# Altium schematic sheet ST_LINK_V2-1.SchDoc: ST_LINK_V2.1
size 320 x 234 mm; Date: 2/28/26; Author: Yasir Shahzad; DrawnBy: Yasir Shahzad; Organization: Mastermind; SheetNumber: 1; SheetTotal: 1
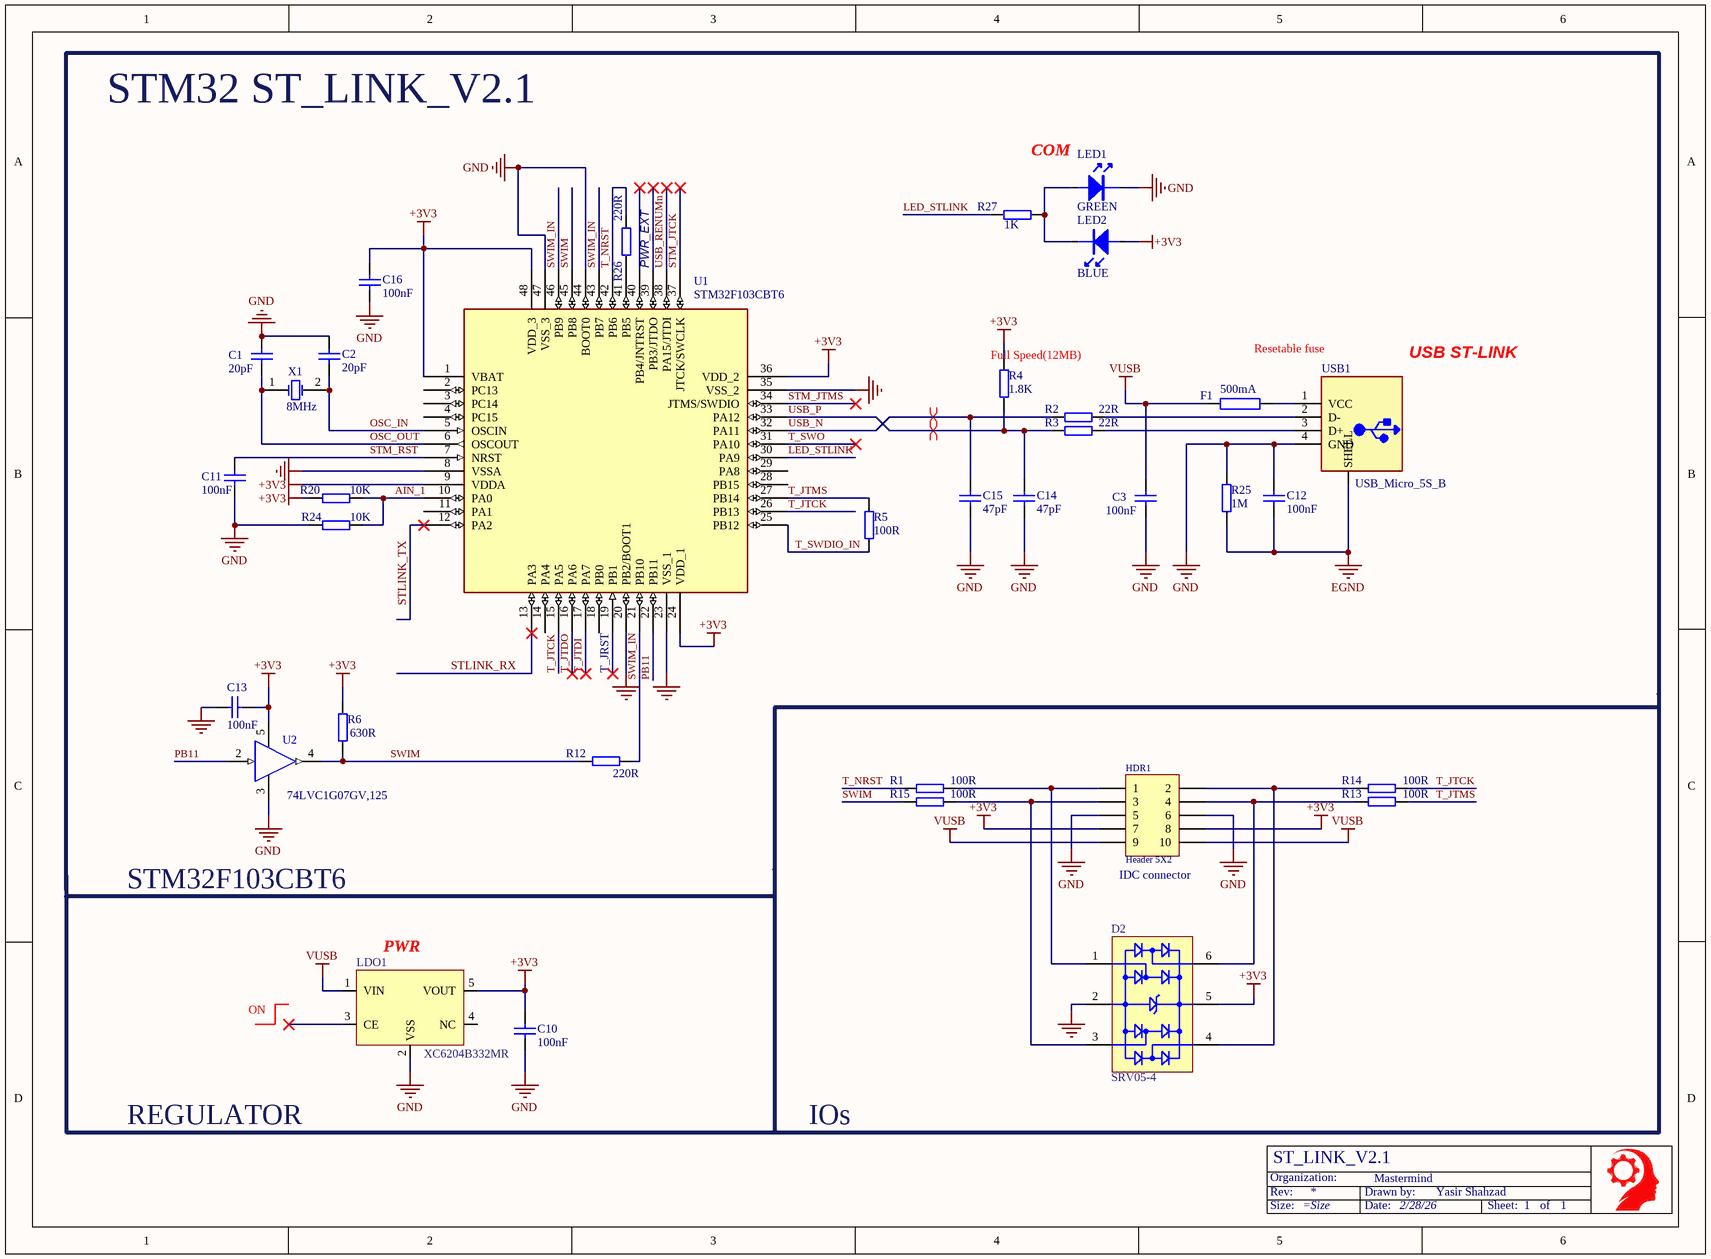
[diagram p0: ST_LINK_V2-1.SchDoc]

## Parts
*  TitleBlock  (value not drawn)  (graphical)
C1  20pF  [C0603-NO]
C2  20pF  [C0603-NO]
C3  100nF  [C0603-NO]
C10  100nF  [C0603-NO]
C11  100nF  [C0603-NO]
C12  100nF  [C0603-NO]
C13  100nF  [C0603-NO]
C14  47pF  [C0603-NO]
C15  47pF  [C0603-NO]
C16  100nF  [C0603-NO]
D2  SRV05-4  [SOT23-6]
F1  value 500mA  [F1206]  (hidden comment: Resistor_FUSE)
HDR1  Header 5X2  [IDC10_2SIDED]
LDO1  XC6204B332MR  [SOT23-5L]
LED1  value GREEN  [CHIPLED_0603 - NO]  (hidden comment: *)
LED2  value BLUE  [CHIPLED_0603 - NO]  (hidden comment: *)
R1  100R  [R0603-NO]
R2  22R  [R0603-NO]
R3  22R  [R0603-NO]
R4  1.8K  [R0603-NO]
R5  100R  [R0603-NO]
R6  630R  [R0603-NO]
R12  220R  [R0603-NO]
R13  100R  [R0603-NO]
R14  100R  [R0603-NO]
R15  100R  [R0603-NO]
R20  10K  [R0603-NO]
R24  10K  [R0603-NO]
R25  1M  [R0603-NO]
R26  220R  [R0603-NO]
R27  1K  [R0603-NO]
U1  STM32F103CBT6  [QFP48 7X7]
U2  74LVC1G07GV,125  [SOT23-5L]
USB1  NAME: USB_Micro_5S_B  [USB-A-SMT_48037-0001]  (hidden comment: USB ConnectorsUSBMINIB - Surface Mount Female Mini-B USB Connector 4UConnector: 06564   By microbuilder.euThru-hole RA Female Mini-B USB Connector 4UConnector: 18732   By ladyada.net)
X1  8MHz  [XTAL1]

## Nets
+3V3: C10.2 C13.2 C16.2 D2.5(VBUS) HDR1.7 HDR1.8 LDO1.5(VOUT) LED2.A R4.1 R6.1 R20.1 U1.1(VBAT) U1.9(VDDA) U1.24(VDD_1) U1.36(VDD_2) U1.48(VDD_3) U2.5(VCC)
EGND: C12.2 R25.2 USB1.5(SHELL)
GND: C1.2 C2.2 C3.1 C10.1 C11.1 C12.1 C13.1 C14.1 C15.1 C16.1 D2.2(GND) HDR1.5 HDR1.6 LDO1.2(VSS) LED1.C(K) R24.2 R25.1 U1.8(VSSA) U1.20(PB2/BOOT1) U1.23(VSS_1) U1.35(VSS_2) U1.44(BOOT0) U1.47(VSS_3) U2.3(GND) USB1.4(GND)
VUSB: C3.2 F1.2 HDR1.9 HDR1.10 LDO1.1(VIN)
AIN_1: R20.2 R24.1 U1.10(PA0)
LED_STLINK: R27.2 U1.30(PA9)
OSC_IN: C2.1 U1.5(OSCIN) X1.2(OSC2)
OSC_OUT: C1.1 U1.6(OSCOUT) X1.1(OSC1)
PB11: U1.22(PB11) U2.2(A)
STLINK_RX: U1.13(PA3)
STLINK_TX: U1.12(PA2)
STM_JTCK: U1.37(JTCK/SWCLK)
STM_JTMS: U1.34(JTMS/SWDIO)
STM_RST: C11.2 U1.7(NRST)
SWIM: R6.2 R12.1 R15.1 U1.45(PB8) U2.4(Y)
SWIM_IN: R12.2 U1.21(PB10) U1.43(PB7) U1.46(PB9)
T_JTCK: R14.2 U1.15(PA5) U1.26(PB13)
T_JTDI: U1.17(PA7)
T_JTDO: U1.16(PA6)
T_JTMS: R5.2 R13.1 U1.27(PB14)
T_NRST: R1.2 R26.1 U1.42(PB6)
T_SWDIO_IN: R5.1 U1.25(PB12)
T_SWO: U1.31(PA10)
USB_N: C15.2 R2.1 U1.32(PA11)
USB_P: C14.2 R3.1 R4.2 U1.33(PA12)
USB_RENUMn: U1.38(PA15/JTDI)
NetD2_1: D2.1(I/O_1) HDR1.1 R1.1
NetD2_3: D2.3(I/O_2) HDR1.3 R15.2
NetD2_4: D2.4(I/O_3) HDR1.2 R14.1
NetD2_6: D2.6(I/O_4) HDR1.4 R13.2
NetF1_1: F1.1 USB1.1(VCC)
NetLED1_A: LED1.A LED2.C(K) R27.1
NetR2_2: R2.2 USB1.2(D-)
NetR3_2: R3.2 USB1.3(D+)
NetR26_2: R26.2 U1.41(PB5)

Not connected (* = marked no-connect by the designer): LDO1 3(CE)* 4(NC); U1 2(PC13) 3(PC14) 4(PC15) 11(PA1) 14(PA4) 18(PB0) 19(PB1)* 28(PB15) 29(PA8) 39(PB3/JTDO)* 40(PB4/JNTRST)*

## Layout directives
differential pair: USB_N, USB_P

## Notes on the sheet
- STM32 ST_LINK_V2.1
- COM
- (near R26) PWR_EXT
- (near R4) Full Speed(12MB)
- (near F1) Resetable fuse
- (near USB1) USB ST-LINK
- (near U1) T_JRST
- (near HDR1) IDC connector
- STM32F103CBT6
- ON
- (near LDO1) PWR
- REGULATOR
- IOs
- (in symbol TitleBlock) Organization:; Rev:; Drawn by:; Size:; Date:; Sheet:; of

## Library data of the parts
* = TitleBlock: Title Block for Schematic Sheets
C1-C3 C10-C16 = Cap_0603: CAP CER ?nF ?V X7R 0603; Value: *
D2 = SRV05-4: Manufacturer: MSKSEMI(美森科); Symbol: SRV05-4_C2836319; Add into BOM: yes; Reverse Stand-Off Voltage (Vrwm): 5V; Maximum Clamping Voltage: 15V; Peak Pulse Power Dissipation (Ppp)@10/1000us: 60W; Breakdown Voltage: 9V; Type: ESD; Device: SRV05-4_C2836319; Supplier: LCSC; Supplier Part: C2836319; Manufacturer Part: SRV05-4; JLCPCB Part Class: Extended Part; LCSC Part Name: SRV05-4; Supplier Footprint: SOT-23-6; Datasheet: https://atta.szlcsc.com/upload/public/pdf/source/20220222/F01BB54FA817A9A0327E7B3253CC806E.pdf; Convert to PCB: yes
F1 = Resistor_FUSE: Resetable fuse
HDR1 = Header 5X2: Header, 5-Pin, Dual row; Revision: 17-Jul-2002: Re-released for DXP Platform.
LDO1 = XC6204B332MR: Manufacturer: TOREX(特瑞仕); Add into BOM: yes; Maximum Input Voltage: 10V; Output Voltage: 3.3V; MAX Output Current: 150mA; Power Supply Rejection Ratio (PSRR): 70dB@(10kHz); Dropout Voltage: 330mV@(100mA); Output Polarity: Positive electrode; Number of Outputs: 1; Symbol: XC6204B332MR; Device: XC6204B332MR; Supplier: LCSC; Manufacturer Part: XC6204B332MR; Supplier Part: C80697; JLCPCB Part Class: Extended Part; LCSC Part Name: 输入10V 输出3.3V 150mA; Supplier Footprint: SOT-23-5; Datasheet: https://atta.szlcsc.com/upload/public/pdf/source/20170421/1492744953040.pdf; Convert to PCB: yes
LED1 LED2 = LEDCHIP-LED0603: SMD lamp beads
R1-R6 R12-R15 R20 R24-R27 = Res_0603: RES SMD ?K OHM 1% 1/10W 0603; Value: *
U1 = STM32F103CBT6: Medium-density performance line ARM-based 32-bit MCU with 64KB Flash; Manuf_Part_1: STM32F103C8T6; Manuf_1: STM; Ref St: 9175981; Provided: ST; ECCN_US/EU: 3A991A2/NEC; Distrib: ST; Order: STM32F103C8T6
U2 = 74LVC1G07GV,125: Manufacturer: Nexperia(安世); Add into BOM: yes; output type: Open Drain; Supply Voltage: 1.65V~5.5V; Number of Elements: 1; Sink Current: 32mA; Logic Family: 74LVC; Symbol: 74LVC1G07GV,125; Device: 74LVC1G07GV,125; LCSC Part Name: 74LVC1G07GV,125; Supplier Part: C12511; Manufacturer Part: 74LVC1G07GV,125; Supplier Footprint: SOT-753; JLCPCB Part Class: Extended Part; Datasheet: https://atta.szlcsc.com/upload/public/pdf/source/20130521/1457706602667.pdf; Supplier: LCSC; Convert to PCB: yes; Number of Bits per Element: 1; Operating Temperature: -40℃~+125℃
USB1 = USB-MALE
X1 = XTAL: Crystal Oscillator; Published: 8-Jun-2000; LatestRevisionDate: 17-Jul-2002; LatestRevisionNote: Re-released for DXP Platform.; PackageReference: R38; Publisher: Altium Limited